# Altium schematic sheet Floor_u_controller.SchDoc
size A
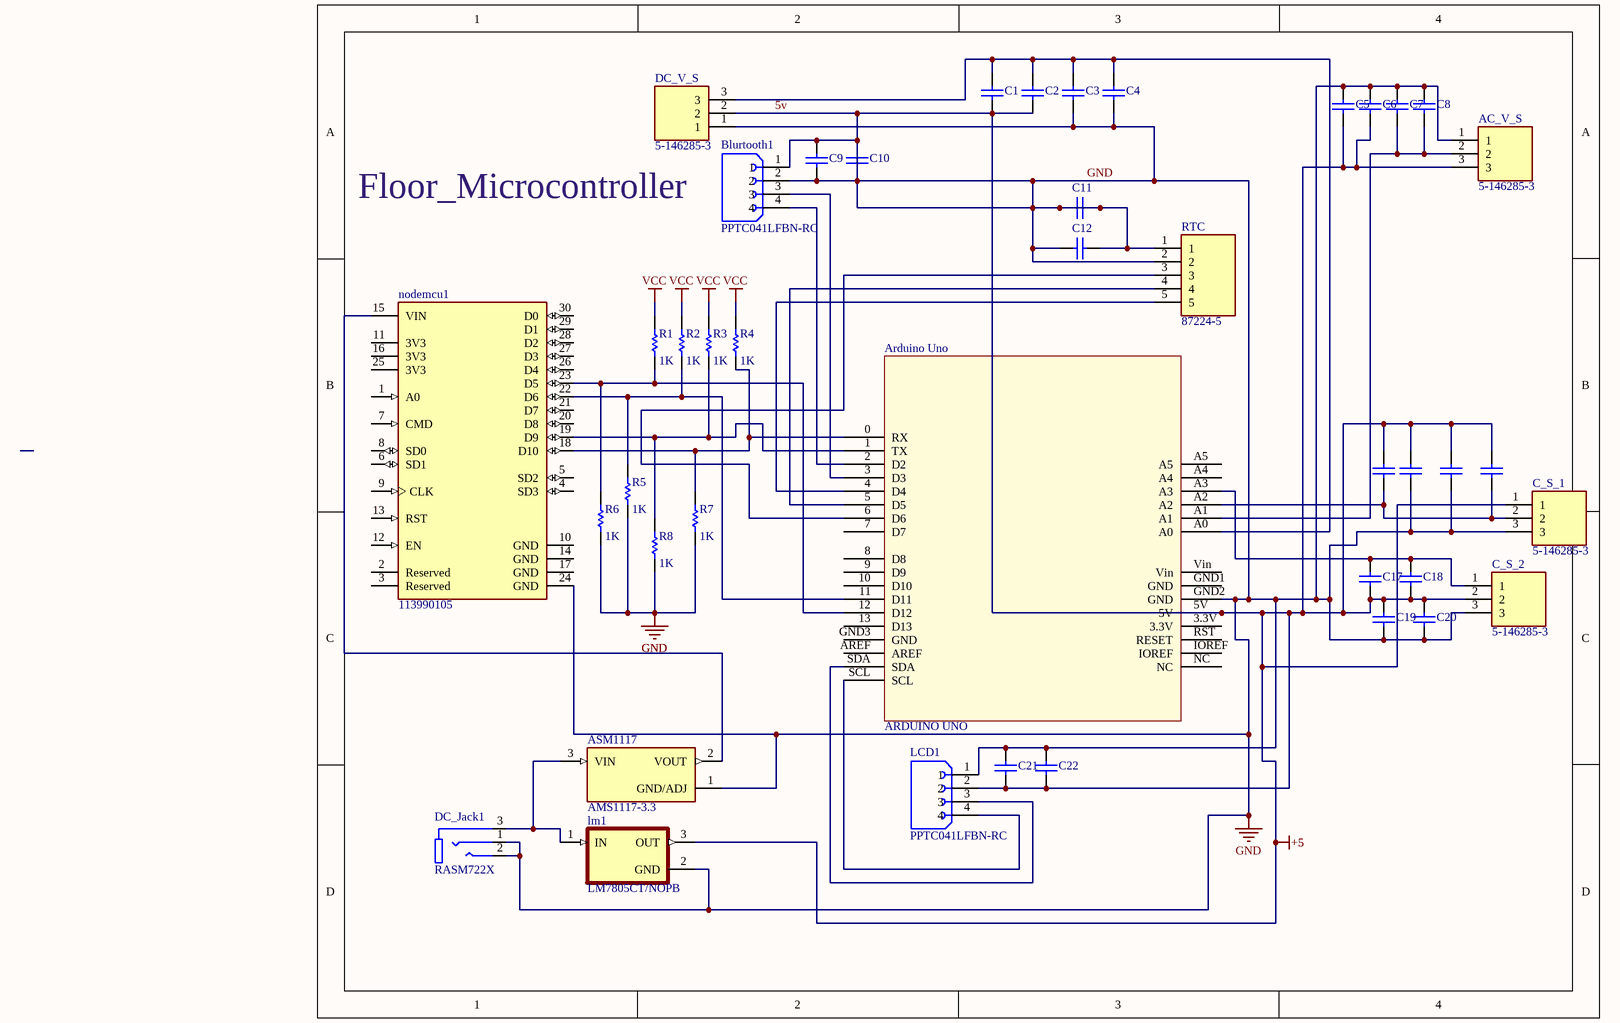
[diagram p0: Floor_u_controller.SchDoc]

## Parts
AC_V_S  5-146285-3  [TE_5-146285-3]
Arduino_Uno  ARDUINO UNO  [ARDUINO UNO]
ASM1117  AMS1117-3.3  [SOT229P700X180-4N]
Blurtooth1  PPTC041LFBN-RC  [SULLINS_PPTC041LFBN-RC]
C1  (no value)  [0805]
C2  (no value)  [0805]
C3  (no value)  [0805]
C4  (no value)  [0805]
C5  (no value)  [0805]
C6  (no value)  [0805]
C7  (no value)  [0805]
C8  (no value)  [0805]
C9  (no value)  [0805]
C10  (no value)  [0805]
C11  (no value)  [0805]
C12  (no value)  [0805]
C13  (no value)  [0805]
C14  (no value)  [0805]
C15  (no value)  [0805]
C16  (no value)  [0805]
C17  (no value)  [0805]
C18  (no value)  [0805]
C19  (no value)  [0805]
C20  (no value)  [0805]
C21  (no value)  [0805]
C22  (no value)  [0805]
C_S_1  5-146285-3  [TE_5-146285-3]
C_S_2  5-146285-3  [TE_5-146285-3]
DC_Jack1  RASM722X  [SWITCHCRAFT_RASM722X]
DC_V_S  5-146285-3  [TE_5-146285-3]
LCD1  PPTC041LFBN-RC  [SULLINS_PPTC041LFBN-RC]
lm1  LM7805CT/NOPB  [TO254P1054X470X2600-3]
nodemcu1  113990105  [FP-113990105-MFG]
R1  value 1K  [0805]
R2  value 1K  [0805]
R3  value 1K  [0805]
R4  value 1K  [0805]
R5  value 1K  [0805]
R6  value 1K  [0805]
R7  value 1K  [0805]
R8  value 1K  [0805]
RTC  87224-5  [TE_87224-5]

## Nets
5v: AC_V_S.1 AC_V_S.3 Arduino_Uno.5V Arduino_Uno.GND2(GND) ASM1117.1(GND/ADJ) Blurtooth1.1 Blurtooth1.2 C1.1 C2.1 C3.1 C4.1 C5.1 C5.2 C6.1 C6.2 C7.2 C8.2 C9.1 C9.2 C10.1 C10.2 C11.1 C11.2 C12.1 C12.2 C13.2 C14.1 C14.2 C15.1 C15.2 C16.2 C17.1 C18.1 C19.1 C19.2 C20.1 C20.2 C21.1 C21.2 C22.1 C22.2 C_S_1.1 C_S_1.3 C_S_2.2 C_S_2.3 DC_Jack1.1(SHUNT) DC_Jack1.2(TIP) DC_V_S.1 DC_V_S.2 LCD1.1 LCD1.2 lm1.2(GND) lm1.3(OUT) nodemcu1.24(GND) R5.1 R6.1 R7.1 R8.1 RTC.1 RTC.2  [also labelled +5, GND]
VCC: R1.2 R2.2 R3.2 R4.2
NetAC_V_S_2: AC_V_S.2 Arduino_Uno.A1 C7.1 C8.1
NetArduino_Uno_0: Arduino_Uno.0(RX) nodemcu1.18(D10) R4.1 R7.2
NetArduino_Uno_1: Arduino_Uno.1(TX) nodemcu1.19(D9) R3.1 R8.2
NetArduino_Uno_2: Arduino_Uno.2(D2) Blurtooth1.4
NetArduino_Uno_3: Arduino_Uno.3(D3) Blurtooth1.3
NetArduino_Uno_4: Arduino_Uno.4(D4) RTC.5
NetArduino_Uno_5: Arduino_Uno.5(D5) RTC.4
NetArduino_Uno_6: Arduino_Uno.6(D6) RTC.3
NetArduino_Uno_11: Arduino_Uno.11(D11) nodemcu1.22(D6) R2.1 R5.2
NetArduino_Uno_12: Arduino_Uno.12(D12) nodemcu1.23(D5) R1.1 R6.2
NetArduino_Uno_A0: Arduino_Uno.A0 C1.2 C2.2 C3.2 C4.2 DC_V_S.3
NetArduino_Uno_A2: Arduino_Uno.A2 C13.1 C16.1 C_S_1.2
NetArduino_Uno_A3: Arduino_Uno.A3 C17.2 C18.2 C_S_2.1
NetArduino_Uno_SCL: Arduino_Uno.SCL LCD1.4
NetArduino_Uno_SDA: Arduino_Uno.SDA LCD1.3
NetASM1117_2: ASM1117.2(VOUT) nodemcu1.15(VIN)
NetASM1117_3: ASM1117.3(VIN) DC_Jack1.3(SLEEVE) lm1.1(IN)

Not connected (* = marked no-connect by the designer): Arduino_Uno 3.3V 7(D7) 8(D8) 9(D9) 10(D10) 13(D13) A4 A5 AREF GND1(GND) GND3(GND) IOREF NC RST(RESET) Vin; nodemcu1 1(A0) 2(Reserved) 3(Reserved) 4(SD3) 5(SD2) 6(SD1) 7(CMD) 8(SD0) 9(CLK) 10(GND) 11(3V3) 12(EN) 13(RST) 14(GND) 16(3V3) 17(GND) 20(D8) 21(D7) 25(3V3) 26(D4) 27(D3) 28(D2) 29(D1) 30(D0)

## Notes on the sheet
- (near Blurtooth1) Floor_Microcontroller

## Library data of the parts
ASM1117 = AMS1117-3.3: Sot223/Pkg 1-Amp 3.3-Volt Low Drop Out Voltage Regulatator; MF: Advanced Monolithic Systems; Package: SOT-223 Seeed Technology; Value: *; Check_prices: https://www.snapeda.com/parts/AMS1117-3.3/Advanced+Monolithic+Systems/view-part/?ref=eda; Price: None; Availability: Not in stock; MP: AMS1117-3.3; SnapEDA_Link: https://www.snapeda.com/parts/AMS1117-3.3/Advanced+Monolithic+Systems/view-part/?ref=snap
Blurtooth1 LCD1 = PPTC041LFBN-RC: 4 Position Header Connector 0.100 (2.54mm) Through Hole Tin; MF: Sullins Connector; Purchase-URL: https://pricing.snapeda.com/search/part/PPTC041LFBN-RC/?ref=eda; Check_prices: https://www.snapeda.com/parts/PPTC041LFBN-RC/Sullins+Connector+Solutions/view-part/?ref=eda; Package: None; SnapEDA_Link: https://www.snapeda.com/parts/PPTC041LFBN-RC/Sullins+Connector+Solutions/view-part/?ref=snap; Value: *; MP: PPTC041LFBN-RC; Digi-Key_Part_Number: S7002-ND
C1-C22 = Cap: Capacitor; Value: 100pF; Published: 8-Jun-2000; LatestRevisionDate: 17-Jul-2002; LatestRevisionNote: Re-released for DXP Platform.; PackageReference: RAD-0.3; Publisher: Altium Limited; PackageDescription: Radial Cap, Thru-Hole; 2 Leads; 0.3 in Pin Spacing
DC_Jack1 = RASM722X: JACK SOCKET, DC; Gender:Jack; Current Rating:5A; Pin Diameter:2mm; Barrel Length:-; Connector Mounting:Surface Mount; Contact Termination Type:Solder; Barrel Inner Diameter:-; Barrel Outer Diameter:6.3mm; Voltage Rating:-; Product Range:-; SVHC:No SVHC (15-Jan-2018); Contact Termination:Solder; Termination Method:Solder; Voltage Rating VAC:250V; MF: Switchcraft; Price: None; Availability: In Stock; Package: None; MP: RASM722X; Value: *; SnapEDA_Link: https://www.snapeda.com/parts/RASM722X/Switchcraft+Inc./view-part/?ref=snap; Purchase-URL: https://pricing.snapeda.com/search/part/RASM722X/?ref=eda; Check_prices: https://www.snapeda.com/parts/RASM722X/Switchcraft+Inc./view-part/?ref=eda
lm1 = LM7805CT/NOPB: Linear Voltage Regulator IC Positive Fixed 1 Output 1.5A TO-220-3; MF: ON Semiconductor; Purchase-URL: https://pricing.snapeda.com/search/part/LM7805CT/?ref=eda; Check_prices: https://www.snapeda.com/parts/LM7805CT/Onsemi/view-part/?ref=eda; SnapEDA_Link: https://www.snapeda.com/parts/LM7805CT/Onsemi/view-part/?ref=snap; Price: None; Availability: In Stock; Package: TO-220-3 ON Semiconductor; MP: LM7805CT; Value: *
nodemcu1 = CMP-138991-000001-1: NODEMCU V2 LUA BASED ESP8266 DEV; Frequency: 2.4GHz; Series: -
R1-R8 = Res1: Resistor; Published: 8-Jun-2000; LatestRevisionDate: 17-Jul-2002; LatestRevisionNote: Re-released for DXP Platform.; PackageReference: AXIAL-0.3; Publisher: Altium Limited; PackageDescription: Axial Device, Thru-Hole; 2 Leads; 0.3 in Pin Spacing
RTC = 87224-5: Conn Unshrouded Header HDR 5 POS 2.54mm Solder ST Thru-Hole; Number_of_Positions: 5; MF: TE Connectivity; Product_Type: Connector; Centerline_Pitch: 2.54 mm[.1 in]; Price: None; SnapEDA_Link: https://www.snapeda.com/parts/87224-5/TE%20Connectivity%20AMP%20Connectors/view-part/1233389/?ref=snap; EU_RoHS_Compliance: Compliant; MP: 87224-5; Value: *; Availability: Good; Package: None; Purchase-URL: https://pricing.snapeda.com/search/part/87224-5/?ref=eda
AC_V_S C_S_1 C_S_2 DC_V_S = 5-146285-3: Price: None; MP: 5-146285-3; Value: *; Availability: Unavailable; Package: None